# Altium schematic sheet OZ440-SE100-CAR003_sheet5.SchDoc
size A3
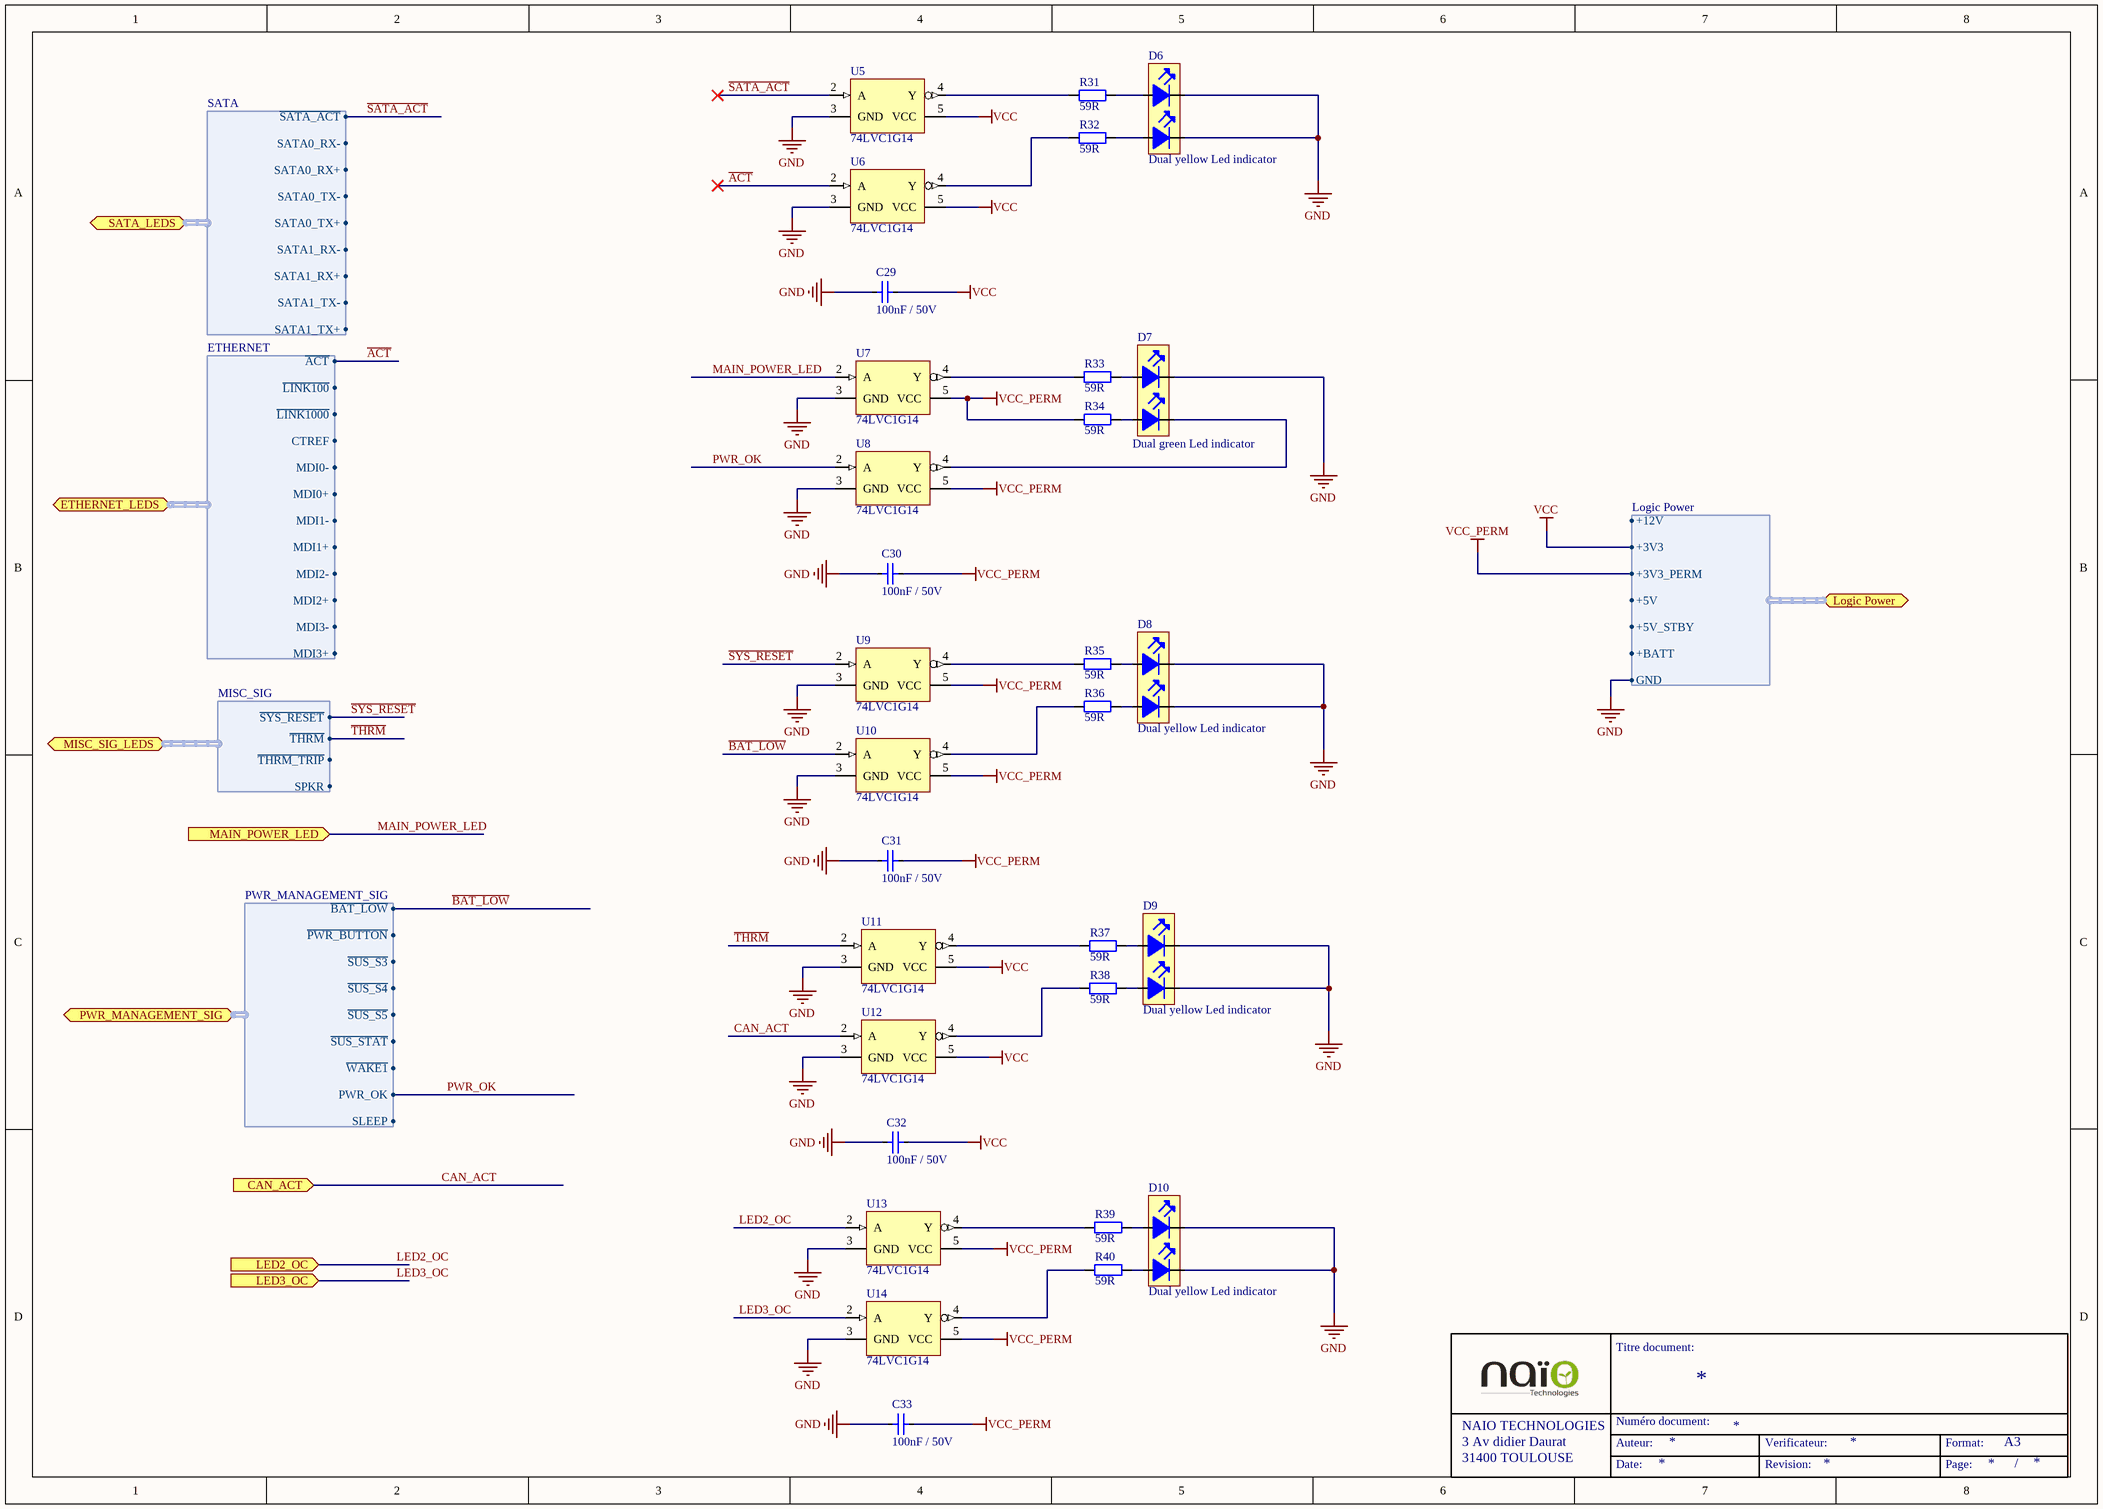
[diagram p0: OZ440-SE100-CAR003_sheet5.SchDoc]

## Parts
C29  Displayed reference: 100nF / 50V  [C0805-STD]  (hidden comment: CAP-SMD)
C30  Displayed reference: 100nF / 50V  [C0805-STD]  (hidden comment: CAP-SMD)
C31  Displayed reference: 100nF / 50V  [C0805-STD]  (hidden comment: CAP-SMD)
C32  Displayed reference: 100nF / 50V  [C0805-STD]  (hidden comment: CAP-SMD)
C33  Displayed reference: 100nF / 50V  [C0805-STD]  (hidden comment: CAP-SMD)
D6  LED_DUAL  [LED_3MM_DUAL]  (value not drawn)
D7  LED_DUAL  [LED_3MM_DUAL]  (value not drawn)
D8  LED_DUAL  [LED_3MM_DUAL]  (value not drawn)
D9  LED_DUAL  [LED_3MM_DUAL]  (value not drawn)
D10  LED_DUAL  [LED_3MM_DUAL]  (value not drawn)
R31  Displayed reference: 59R  [R0805-STD]  (hidden comment: RES-SMD)
R32  Displayed reference: 59R  [R0805-STD]  (hidden comment: RES-SMD)
R33  Displayed reference: 59R  [R0805-STD]  (hidden comment: RES-SMD)
R34  Displayed reference: 59R  [R0805-STD]  (hidden comment: RES-SMD)
R35  Displayed reference: 59R  [R0805-STD]  (hidden comment: RES-SMD)
R36  Displayed reference: 59R  [R0805-STD]  (hidden comment: RES-SMD)
R37  Displayed reference: 59R  [R0805-STD]  (hidden comment: RES-SMD)
R38  Displayed reference: 59R  [R0805-STD]  (hidden comment: RES-SMD)
R39  Displayed reference: 59R  [R0805-STD]  (hidden comment: RES-SMD)
R40  Displayed reference: 59R  [R0805-STD]  (hidden comment: RES-SMD)
U5  Displayed reference: 74LVC1G14  [SOT353-1_5pin-STD]  (hidden comment: 74xxx1G14GW-SOT353-1)
U6  Displayed reference: 74LVC1G14  [SOT353-1_5pin-STD]  (hidden comment: 74xxx1G14GW-SOT353-1)
U7  Displayed reference: 74LVC1G14  [SOT353-1_5pin-STD]  (hidden comment: 74xxx1G14GW-SOT353-1)
U8  Displayed reference: 74LVC1G14  [SOT353-1_5pin-STD]  (hidden comment: 74xxx1G14GW-SOT353-1)
U9  Displayed reference: 74LVC1G14  [SOT353-1_5pin-STD]  (hidden comment: 74xxx1G14GW-SOT353-1)
U10  Displayed reference: 74LVC1G14  [SOT353-1_5pin-STD]  (hidden comment: 74xxx1G14GW-SOT353-1)
U11  Displayed reference: 74LVC1G14  [SOT353-1_5pin-STD]  (hidden comment: 74xxx1G14GW-SOT353-1)
U12  Displayed reference: 74LVC1G14  [SOT353-1_5pin-STD]  (hidden comment: 74xxx1G14GW-SOT353-1)
U13  Displayed reference: 74LVC1G14  [SOT353-1_5pin-STD]  (hidden comment: 74xxx1G14GW-SOT353-1)
U14  Displayed reference: 74LVC1G14  [SOT353-1_5pin-STD]  (hidden comment: 74xxx1G14GW-SOT353-1)

## Ports
CAN_ACT (in), ETHERNET_LEDS (harness ETHERNET), LED2_OC (in), LED3_OC (in), Logic Power (harness Logic Power), MAIN_POWER_LED (in), MISC_SIG_LEDS (harness MISC_SIG), PWR_MANAGEMENT_SIG (harness PWR_MANAGEMENT_SIG), SATA_LEDS (harness SATA)

## Harnesses
SATA: ~{SATA_ACT}, SATA0_RX-, SATA0_RX+, SATA0_TX-, SATA0_TX+, SATA1_RX-, SATA1_RX+, SATA1_TX-, SATA1_TX+
ETHERNET: ~{ACT}, ~{LINK100}, ~{LINK1000}, CTREF, MDI0-, MDI0+, MDI1-, MDI1+, MDI2-, MDI2+, MDI3-, MDI3+
MISC_SIG: ~{SYS_RESET}, ~{THRM}, ~{THRM_TRIP}, SPKR
PWR_MANAGEMENT_SIG: ~{BAT_LOW}, ~{PWR_BUTTON}, ~{SUS_S3}, ~{SUS_S4}, ~{SUS_S5}, ~{SUS_STAT}, ~{WAKE1}, PWR_OK, SLEEP
Logic Power: +12V, +3V3, +3V3_PERM, +5V, +5V_STBY, +BATT, GND

## Nets
GND: C29.1 C30.1 C31.1 C32.1 C33.1 D6.K1 D6.K2 D7.K1 D8.K1 D8.K2 D9.K1 D9.K2 D10.K1 D10.K2 U5.3(GND) U6.3(GND) U7.3(GND) U8.3(GND) U9.3(GND) U10.3(GND) U11.3(GND) U12.3(GND) U13.3(GND) U14.3(GND) ; port Logic Power.GND
VCC: C29.2 C32.2 U5.5(VCC) U6.5(VCC) U11.5(VCC) U12.5(VCC) ; port Logic Power.+3V3
VCC_PERM: C30.2 C31.2 C33.2 R34.1 U7.5(VCC) U8.5(VCC) U9.5(VCC) U10.5(VCC) U13.5(VCC) U14.5(VCC) ; port Logic Power.+3V3_PERM
~{ACT}: U6.2(A) ; port ETHERNET_LEDS.~{ACT}
~{BAT_LOW}: U10.2(A) ; port PWR_MANAGEMENT_SIG.~{BAT_LOW}
~{SATA_ACT}: U5.2(A) ; port SATA_LEDS.~{SATA_ACT}
~{SYS_RESET}: U9.2(A) ; port MISC_SIG_LEDS.~{SYS_RESET}
~{THRM}: U11.2(A) ; port MISC_SIG_LEDS.~{THRM}
CAN_ACT: U12.2(A) ; port CAN_ACT
LED2_OC: U13.2(A) ; port LED2_OC
LED3_OC: U14.2(A) ; port LED3_OC
MAIN_POWER_LED: U7.2(A) ; port MAIN_POWER_LED
PWR_OK: U8.2(A) ; port PWR_MANAGEMENT_SIG.PWR_OK
NetD6_A1: D6.A1 R31.2
NetD6_A2: D6.A2 R32.2
NetD7_A1: D7.A1 R33.2
NetD7_A2: D7.A2 R34.2
NetD7_K2: D7.K2 U8.4(Y)
NetD8_A1: D8.A1 R35.2
NetD8_A2: D8.A2 R36.2
NetD9_A1: D9.A1 R37.2
NetD9_A2: D9.A2 R38.2
NetD10_A1: D10.A1 R39.2
NetD10_A2: D10.A2 R40.2
NetR31_1: R31.1 U5.4(Y)
NetR32_1: R32.1 U6.4(Y)
NetR33_1: R33.1 U7.4(Y)
NetR35_1: R35.1 U9.4(Y)
NetR36_1: R36.1 U10.4(Y)
NetR37_1: R37.1 U11.4(Y)
NetR38_1: R38.1 U12.4(Y)
NetR39_1: R39.1 U13.4(Y)
NetR40_1: R40.1 U14.4(Y)

## Notes on the sheet
- Titre document:
- NAIO TECHNOLOGIES
- 3 Av didier Daurat
- 31400 TOULOUSE
- Auteur:
- Numéro document:
- Verificateur:
- Format:
- A3
- Date:
- Revision:
- Page:
- /

## Library data of the parts
C29-C33 = VJ0805Y104KXAxx: 0805 100nF / 50V  X7R ceramic capacitor; Manufacturer: vishay; Max Voltage: 50; Tolerance: +/- 10%; Validated: N; Reference: VJ0805Y104KXAxx; Value: 100nF; Material: X7R; Footprint description: standard Capacitor 0805; Pin Count: 2; helpURL: http://www.vishay.com/docs/45200/highrels.pdf; Supplier 1: Farnell; Supplier Part Number 1: 1612208; Supplier 2: Digi-Key; Supplier Part Number 2: 720-1266-6-ND
D6 D8-D10 = WP934MD/2YD: Dual Yellow led indicator; Manufacturer: KINGBRIGHT; Validated: False; Reference: WP934MD/2YD; Displayed reference: Dual yellow Led indicator; Footprint description: TH 4 pin; Pin Count: 4; Rev: 7.B; helpURL: http://www.mouser.com/ds/2/216/WP934MD-2GD-75217.pdf; Supplier 1: Mouser; Supplier Part Number 1: 604-WP934MD2YD; Supplier 2: Digi-Key; Supplier Part Number 2: WP934MD/2YD-ND
D7 = WP934MD/2GD: Dual green led indicator; Manufacturer: KINGBRIGHT; Validated: False; Reference: WP934MD/2GD; Displayed reference: Dual green Led indicator; Footprint description: TH 4 pin; Pin Count: 4; Rev: 7.B; helpURL: http://www.mouser.com/ds/2/216/WP934MD-2GD-75217.pdf; Supplier 1: Mouser; Supplier Part Number 1: 604-WP934MD/2GD; Supplier 2: Digi-Key; Supplier Part Number 2: 754-1748-ND
R31-R40 = CRCW080559R0FKxx: 59 Ohm 0805 SMD resistor; Manufacturer: Vishay; Value: 59; Tolerance: 1 %; Rated Power: 0.125 W; Validated: No; Reference: CRCW080559R0FKxx; Footprint description: standard 0805 SMD; Pin Count: 2; helpURL: http://www.vishay.com/docs/20035/dcrcwe3.pdf; Supplier 1: Mouser; Supplier Part Number 1: 71-CRCW080559R0FKEA; Supplier 2: Farnell; Supplier Part Number 2: 2138817
U5-U14 = 74LVC1G14GW: smith trigger inverter; Manufacturer: NXP; Max Voltage: 5,5V; Validated: False; Reference: 74LVC1G14GW; Footprint description: SOT353-1, 5 pin; Pin Count: 5; helpURL: http://www.nxp.com/documents/data_sheet/74LVC1G14.pdf; Supplier 1: Farnell; Supplier Part Number 1: 1631687; Supplier 2: Digi-Key; Supplier Part Number 2: 568-2267-1-ND